# EAGLE schematic schematic (EAGLE 7.3.0)
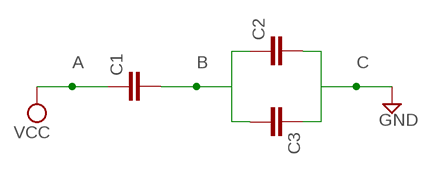
[diagram p0: schematic, sheet 1]

## Parts
C1  C5/2.5  [C5B2.5]
C2  C5/2.5  [C5B2.5]
C3  C5/2.5  [C5B2.5]

## Nets
A: C1.1 ; supply symbol labelled VCC
B: C1.2 C2.1 C3.2
C: C2.2 C3.1 ; supply symbol labelled GND

## Library data of the parts
C1-C3 = capacitor-wima:C: CAPACITOR naming: grid - package width